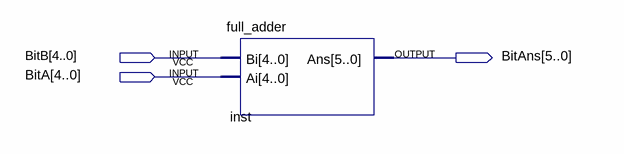
[diagram p0: schematic sheet]
// Quartus schematic circuit_adder_complete.bdf as structural Verilog: 1 symbols, 3 pins
module circuit_adder_complete (
  input  [4:0] BitB,
  input  [4:0] BitA,
  output [5:0] BitAns
);

  full_adder inst (.Bi(BitB), .Ai(BitA), .Ans(BitAns));
endmodule
